# EAGLE design sonar_amp (EAGLE 8.6.1)
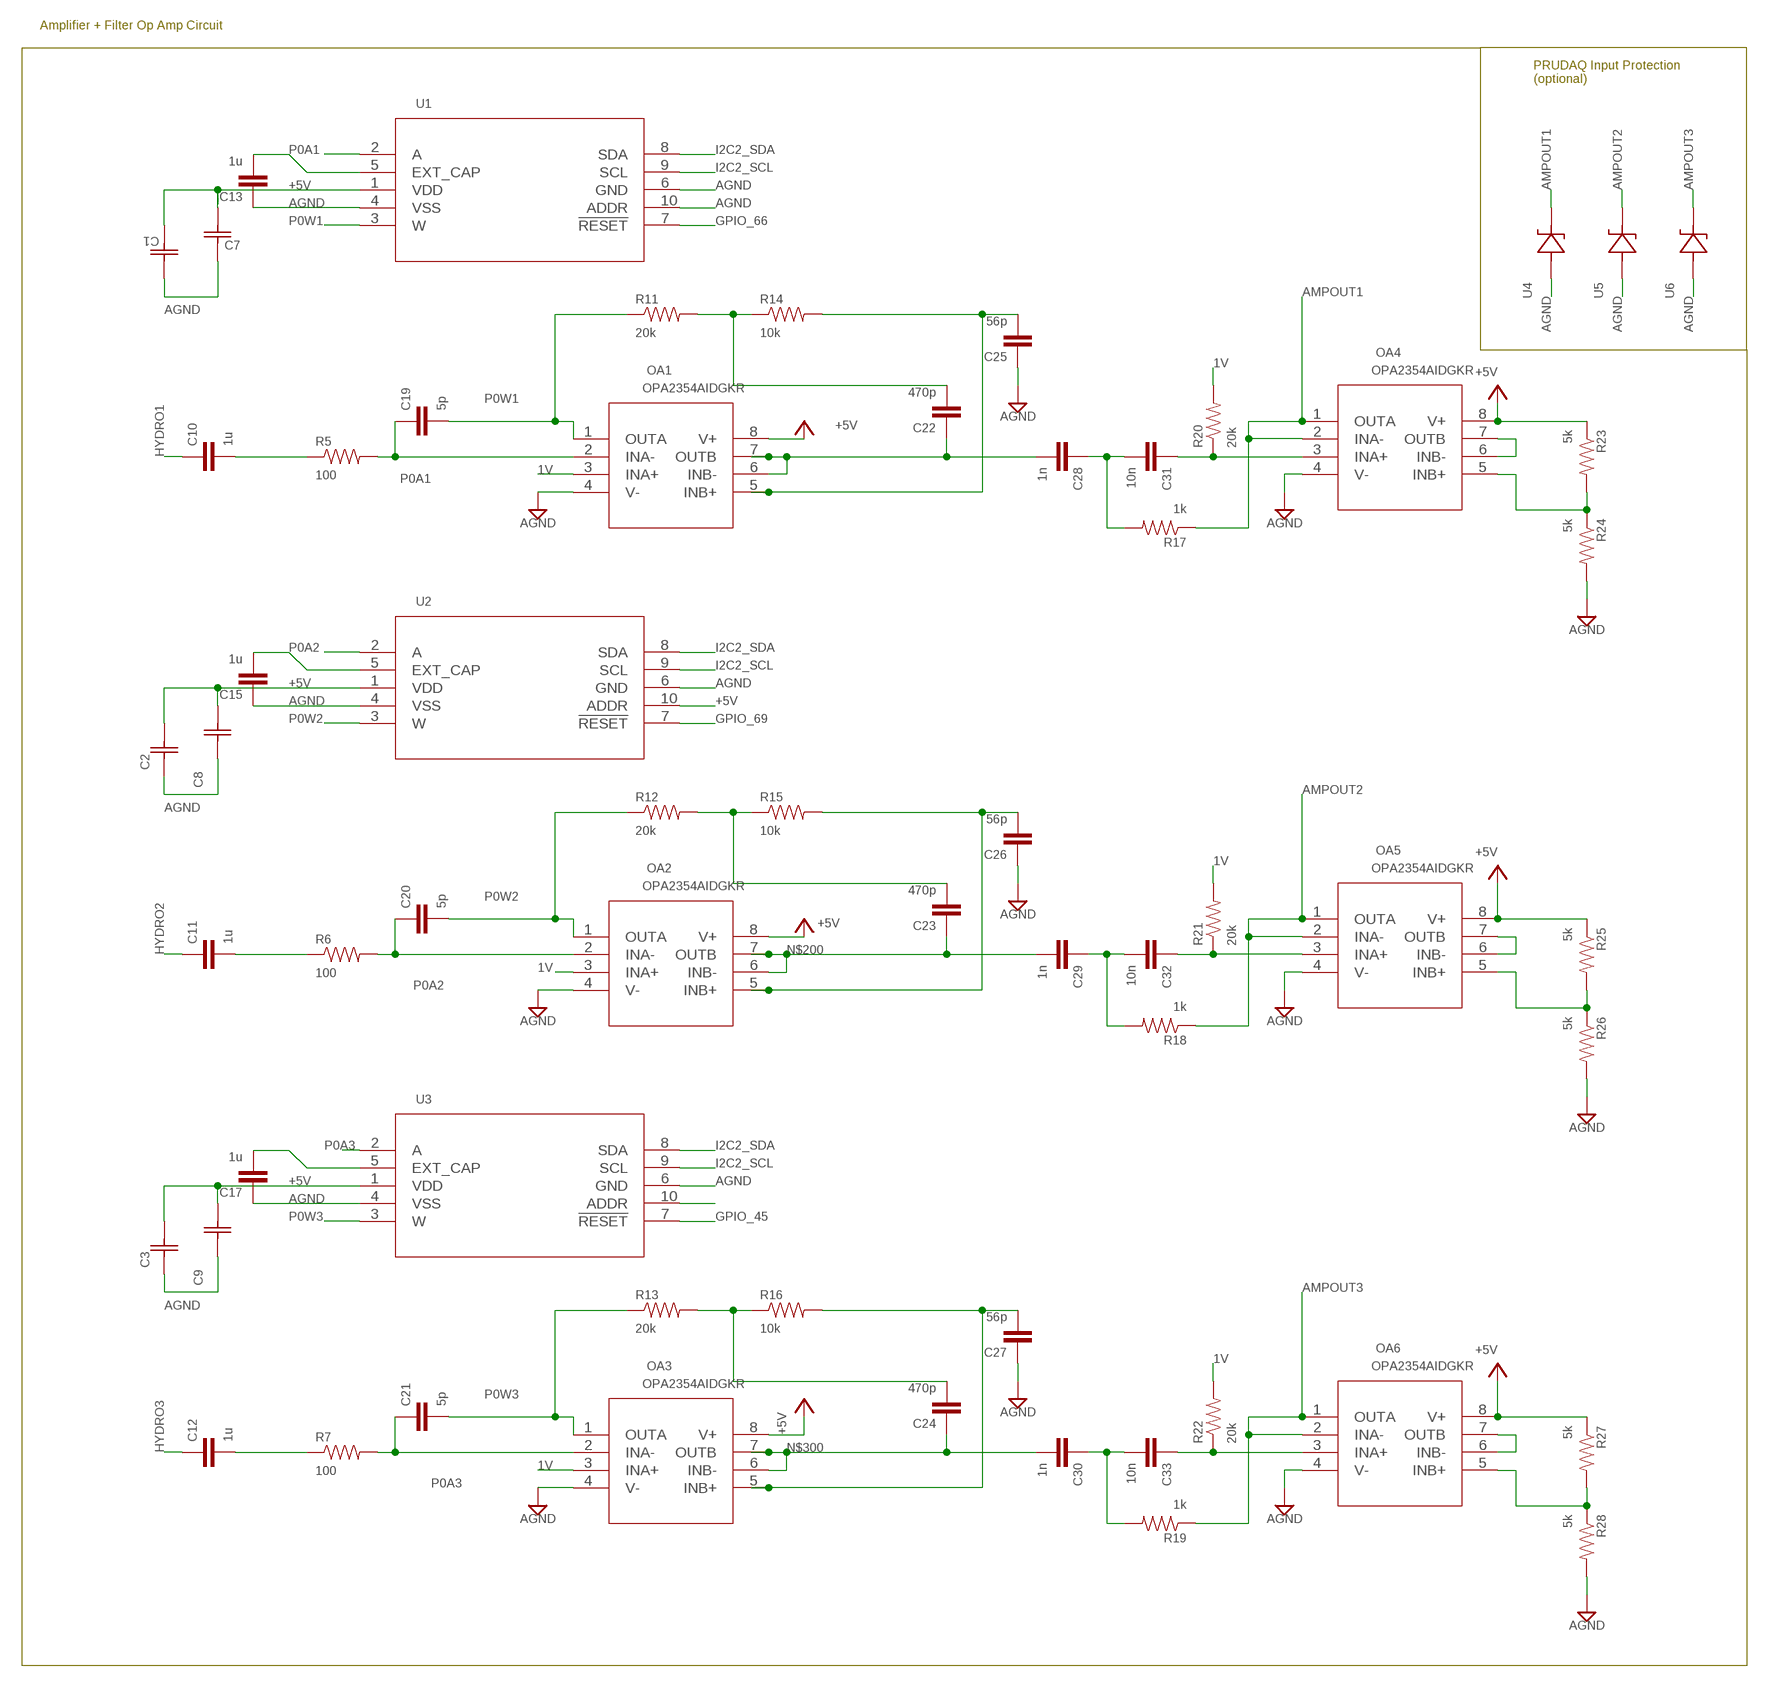
[diagram p0: schematic, sheet 1, part 1 of 2]
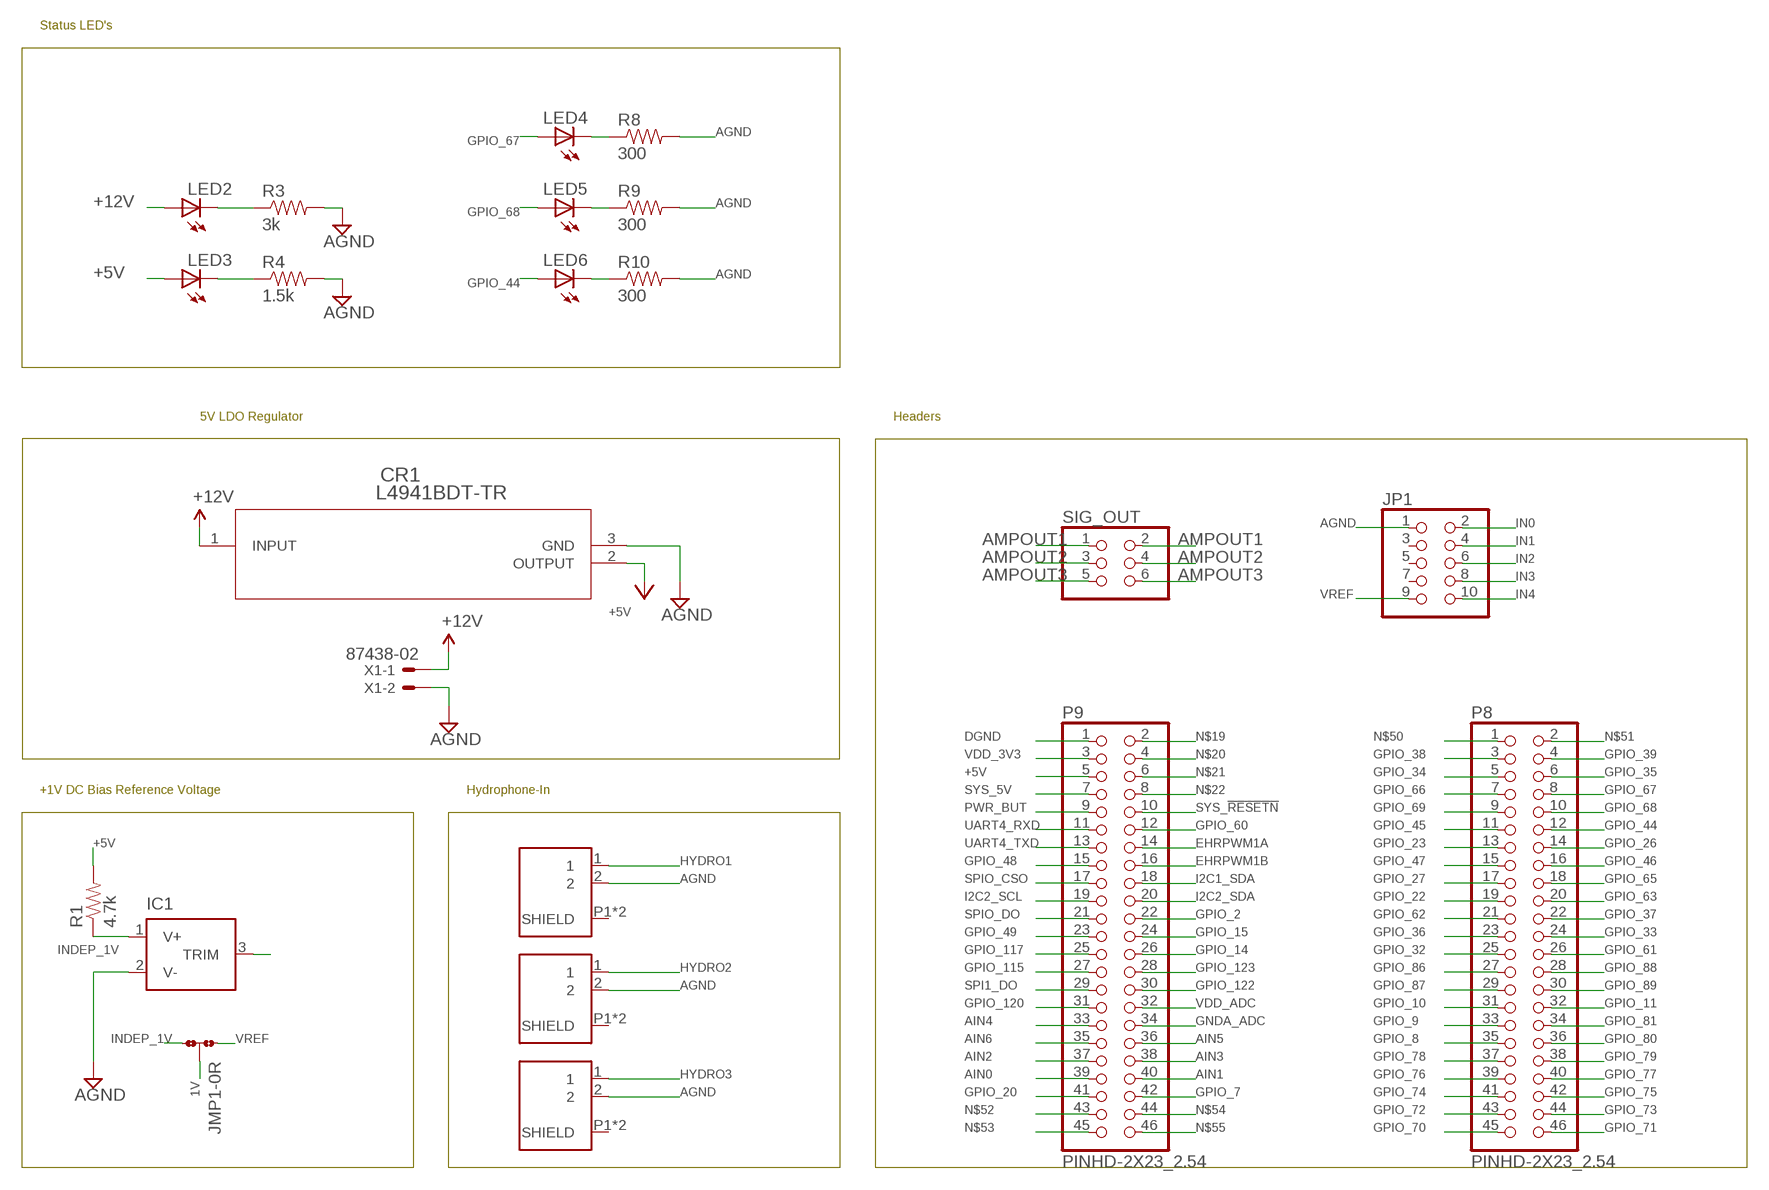
[diagram p1: schematic, sheet 1, part 2 of 2]

## Parts
C1  CC0805KRX7R7BB104  [CC0805N]
C2  CC0805KRX7R7BB104  [CC0805N]
C3  CC0805KRX7R7BB104  [CC0805N]
C7  CC0805ZKY5V6BB106  [YAG_CC0805]
C8  CC0805ZKY5V6BB106  [YAG_CC0805]
C9  CC0805ZKY5V6BB106  [YAG_CC0805]
C10  1u  1UF-25V-10%(0805)"  [0805-CAP]
C11  1u  1UF-25V-10%(0805)"  [0805-CAP]
C12  1u  1UF-25V-10%(0805)"  [0805-CAP]
C13  1u  1UF-25V-10%(0805)"  [0805-CAP]
C15  1u  1UF-25V-10%(0805)"  [0805-CAP]
C17  1u  1UF-25V-10%(0805)"  [0805-CAP]
C19  5p  1UF-25V-10%(0805)"  [0805-CAP]
C20  5p  1UF-25V-10%(0805)"  [0805-CAP]
C21  5p  1UF-25V-10%(0805)"  [0805-CAP]
C22  470p  1UF-25V-10%(0805)"  [0805-CAP]
C23  470p  1UF-25V-10%(0805)"  [0805-CAP]
C24  470p  1UF-25V-10%(0805)"  [0805-CAP]
C25  56p  1UF-25V-10%(0805)"  [0805-CAP]
C26  56p  1UF-25V-10%(0805)"  [0805-CAP]
C27  56p  1UF-25V-10%(0805)"  [0805-CAP]
C28  1n  1UF-25V-10%(0805)"  [0805-CAP]
C29  1n  1UF-25V-10%(0805)"  [0805-CAP]
C30  1n  1UF-25V-10%(0805)"  [0805-CAP]
C31  10n  1UF-25V-10%(0805)"  [0805-CAP]
C32  10n  1UF-25V-10%(0805)"  [0805-CAP]
C33  10n  1UF-25V-10%(0805)"  [0805-CAP]
CR1  L4941BDT-TR  [DPAK]
IC1  ADR510  [SOT23]
J1  1-1337543-0  [CONN_1-1337543-0]
J2  1-1337543-0  [CONN_1-1337543-0]
J3  1-1337543-0  [CONN_1-1337543-0]
JMP1  0R-JUMPC  [C0R-JMP]
JP1  PINHD-2X5  [2X05]
LED2  LEDSMT1206  [1206]
LED3  LEDSMT1206  [1206]
LED4  LEDSMT1206  [1206]
LED5  LEDSMT1206  [1206]
LED6  LEDSMT1206  [1206]
OA1  OPA2354AIDGKR  [DGK8]
OA2  OPA2354AIDGKR  [DGK8]
OA3  OPA2354AIDGKR  [DGK8]
OA4  OPA2354AIDGKR  [DGK8]
OA5  OPA2354AIDGKR  [DGK8]
OA6  OPA2354AIDGKR  [DGK8]
P8  PINHD-2X23_2.54  [2X23]
P9  PINHD-2X23_2.54  [2X23]
R1  4.7k  0.3OHM-1/8W-1%(0805)  [0805]
R3  3k  0.3OHM-1/8W-1%(0805)  [0805]
R4  1.5k  0.3OHM-1/8W-1%(0805)  [0805]
R5  100  0.3OHM-1/8W-1%(0805)  [0805]
R6  100  0.3OHM-1/8W-1%(0805)  [0805]
R7  100  0.3OHM-1/8W-1%(0805)  [0805]
R8  300  0.3OHM-1/8W-1%(0805)  [0805]
R9  300  0.3OHM-1/8W-1%(0805)  [0805]
R10  300  0.3OHM-1/8W-1%(0805)  [0805]
R11  20k  0.3OHM-1/8W-1%(0805)  [0805]
R12  20k  0.3OHM-1/8W-1%(0805)  [0805]
R13  20k  0.3OHM-1/8W-1%(0805)  [0805]
R14  10k  0.3OHM-1/8W-1%(0805)  [0805]
R15  10k  0.3OHM-1/8W-1%(0805)  [0805]
R16  10k  0.3OHM-1/8W-1%(0805)  [0805]
R17  1k  0.3OHM-1/8W-1%(0805)  [0805]
R18  1k  0.3OHM-1/8W-1%(0805)  [0805]
R19  1k  0.3OHM-1/8W-1%(0805)  [0805]
R20  20k  0.3OHM-1/8W-1%(0805)  [0805]
R21  20k  0.3OHM-1/8W-1%(0805)  [0805]
R22  20k  0.3OHM-1/8W-1%(0805)  [0805]
R23  5k  0.3OHM-1/8W-1%(0805)  [0805]
R24  5k  0.3OHM-1/8W-1%(0805)  [0805]
R25  5k  0.3OHM-1/8W-1%(0805)  [0805]
R26  5k  0.3OHM-1/8W-1%(0805)  [0805]
R27  5k  0.3OHM-1/8W-1%(0805)  [0805]
R28  5k  0.3OHM-1/8W-1%(0805)  [0805]
SIG_OUT  PINHD-2X3  [2X03]
U1  AD5272BRMZ-20RM_10-L  [RM_10-L]
U2  AD5272BRMZ-20RM_10-L  [RM_10-L]
U3  AD5272BRMZ-20RM_10-L  [RM_10-L]
U4  CZRF52C2CZRF-M  [CZRF-M]
U5  CZRF52C2CZRF-M  [CZRF-M]
U6  CZRF52C2CZRF-M  [CZRF-M]
X1  87438-02  [87438-02]

## Nets
1V: JMP1.2 OA1.3(INA+) OA2.3(INA+) OA3.3(INA+) R20.2 R21.2 R22.2
+5V: C1.2 C2.2 C3.2 C7.2 C8.2 C9.2 CR1.2(OUTPUT) LED3.A OA1.8(V+) OA2.8(V+) OA3.8(V+) OA4.8(V+) OA5.8(V+) OA6.8(V+) P9.5 R1.2 R23.1 R25.1 R27.1 U1.1(VDD) U2.1(VDD) U2.10(ADDR) U3.1(VDD)
+12V: CR1.1(INPUT) LED2.A X1.1
AGND: C1.1 C2.1 C3.1 C7.1 C8.1 C9.1 C13.1 C15.1 C17.1 C25.1 C26.1 C27.1 CR1.3(GND) IC1.2(V-) J1.2 J2.2 J3.2 JP1.1 OA1.4(V-) OA2.4(V-) OA3.4(V-) OA4.4(V-) OA5.4(V-) OA6.4(V-) R3.2 R4.2 R8.2 R9.2 R10.2 R24.2 R26.2 R28.2 U1.4(VSS) U1.6(GND) U1.10(ADDR) U2.4(VSS) U2.6(GND) U3.4(VSS) U3.6(GND) U4.2 U5.2 U6.2 X1.2
AIN0: P9.39
AIN1: P9.40
AIN2: P9.37
AIN3: P9.38
AIN4: P9.33
AIN5: P9.36
AIN6: P9.35
AMPOUT1: OA4.1(OUTA) OA4.2(INA-) R17.1 SIG_OUT.1 SIG_OUT.2 U4.1
AMPOUT2: OA5.1(OUTA) OA5.2(INA-) R18.1 SIG_OUT.3 SIG_OUT.4 U5.1
AMPOUT3: OA6.1(OUTA) OA6.2(INA-) R19.1 SIG_OUT.5 SIG_OUT.6 U6.1
DGND: P9.1
EHRPWM1A: P9.14
EHRPWM1B: P9.16
EXT_CAP: C13.2 U1.5(EXT_CAP)
GNDA_ADC: P9.34
GPIO_2: P9.22
GPIO_7: P9.42
GPIO_8: P8.35
GPIO_9: P8.33
GPIO_10: P8.31
GPIO_11: P8.32
GPIO_14: P9.26
GPIO_15: P9.24
GPIO_20: P9.41
GPIO_22: P8.19
GPIO_23: P8.13
GPIO_26: P8.14
GPIO_27: P8.17
GPIO_32: P8.25
GPIO_33: P8.24
GPIO_34: P8.5
GPIO_35: P8.6
GPIO_36: P8.23
GPIO_37: P8.22
GPIO_38: P8.3
GPIO_39: P8.4
GPIO_44: LED6.A P8.12
GPIO_45: P8.11 U3.7(!RESET)
GPIO_46: P8.16
GPIO_47: P8.15
GPIO_48: P9.15
GPIO_49: P9.23
GPIO_60: P9.12
GPIO_61: P8.26
GPIO_62: P8.21
GPIO_63: P8.20
GPIO_65: P8.18
GPIO_66: P8.7 U1.7(!RESET)
GPIO_67: LED4.A P8.8
GPIO_68: LED5.A P8.10
GPIO_69: P8.9 U2.7(!RESET)
GPIO_70: P8.45
GPIO_71: P8.46
GPIO_72: P8.43
GPIO_73: P8.44
GPIO_74: P8.41
GPIO_75: P8.42
GPIO_76: P8.39
GPIO_77: P8.40
GPIO_78: P8.37
GPIO_79: P8.38
GPIO_80: P8.36
GPIO_81: P8.34
GPIO_86: P8.27
GPIO_87: P8.29
GPIO_88: P8.28
GPIO_89: P8.30
GPIO_115: P9.27
GPIO_117: P9.25
GPIO_120: P9.31
GPIO_122: P9.30
GPIO_123: P9.28
HYDRO1: C10.1 J1.1
HYDRO2: C11.1 J2.1
HYDRO3: C12.1 J3.1
I2C1_SDA: P9.18
I2C2_SCL: P9.19 U1.9(SCL) U2.9(SCL) U3.9(SCL)
I2C2_SDA: P9.20 U1.8(SDA) U2.8(SDA) U3.8(SDA)
IN0: JP1.2
IN1: JP1.4
IN2: JP1.6
IN3: JP1.8
IN4: JP1.10
INDEP_1V: IC1.1(V+) JMP1.3 R1.1
N$1: C23.2 R12.2 R15.1
N$2: C22.2 R11.2 R14.1
N$3: C29.1 C32.2 R18.2
N$4: IC1.3(TRIM)
N$5: C32.1 OA5.3(INA+) R21.1
N$6: C28.1 C31.2 R17.2
N$7: C31.1 OA4.3(INA+) R20.1
N$9: LED2.C R3.1
N$10: LED3.C R4.1
N$11: LED4.C R8.1
N$12: OA6.5(INB+) R27.2 R28.1
N$13: C24.2 R13.2 R16.1
N$14: C30.1 C33.2 R19.2
N$15: C33.1 OA6.3(INA+) R22.1
N$16: OA6.6(INB-) OA6.7(OUTB)
N$17: OA4.5(INB+) R23.2 R24.1
N$18: LED5.C R9.1
N$19: P9.2
N$20: P9.4
N$21: P9.6
N$22: P9.8
N$23: LED6.C R10.1
N$25: C15.2 U2.5(EXT_CAP)
N$26: C17.2 U3.5(EXT_CAP)
N$27: U3.10(ADDR)
N$28: OA4.6(INB-) OA4.7(OUTB)
N$31: C22.1 C28.2 OA1.6(INB-) OA1.7(OUTB)
N$32: OA5.6(INB-) OA5.7(OUTB)
N$33: OA5.5(INB+) R25.2 R26.1
N$35: C26.2 OA2.5(INB+) R15.2
N$50: P8.1
N$51: P8.2
N$52: P9.43
N$53: P9.45
N$54: P9.44
N$55: P9.46
N$101: C25.2 OA1.5(INB+) R14.2
N$200: C23.1 C29.2 OA2.6(INB-) OA2.7(OUTB)
N$201: C27.2 OA3.5(INB+) R16.2
N$300: C24.1 C30.2 OA3.6(INB-) OA3.7(OUTB)
P0A1: C19.1 OA1.2(INA-) R5.2 U1.2(A)
P0A2: C20.1 OA2.2(INA-) R6.2 U2.2(A)
P0A3: C21.1 OA3.2(INA-) R7.2 U3.2(A)
P0W1: C19.2 OA1.1(OUTA) R11.1 U1.3(W)
P0W2: C20.2 OA2.1(OUTA) R12.1 U2.3(W)
P0W3: C21.2 OA3.1(OUTA) R13.1 U3.3(W)
POB: C10.2 R5.1
POB1: C11.2 R6.1
POB2: C12.2 R7.1
PWR_BUT: P9.9
SPI1_DO: P9.29
SPIO_CSO: P9.17
SPIO_DO: P9.21
SYS_5V: P9.7
SYS_!RESETN: P9.10
UART4_RXD: P9.11
UART4_TXD: P9.13
VDD_3V3: P9.3
VDD_ADC: P9.32
VREF: JMP1.1 JP1.9
Unconnected: J1.P1(SHIELD) J1.P2(SHIELD) J2.P1(SHIELD) J2.P2(SHIELD) J3.P1(SHIELD) J3.P2(SHIELD) JP1.3 JP1.5 JP1.7

## Notes on the sheet
- Amplifier + Filter Op Amp Circuit
- PRUDAQ Input Protection
  (optional)
- Status LED's
- 5V LDO Regulator | Headers
- +1V DC Bias Reference Voltage | Hydrophone-In

## Library data of the parts
C1-C3 = CC0805KRX7R7BB104:CC0805KRX7R7BB104; MANUFACTURER_PART_NUMBER: CC0805KRX7R7BB104; VENDOR: Yageo
C7-C9 = CC0805ZKY5V6BB106:CC0805ZKY5V6BB106; MANUFACTURER_PART_NUMBER: CC0805ZKY5V6BB106; VENDOR: Yageo
C10-C13 C15 C17 C19-C33 = SparkFun-Capacitors:1UF-25V-10%(0805): CAP-08064
CR1 = L4941BDT-TR:L4941BDT-TR; MANUFACTURER_PART_NUMBER: L4941BDTTR; VENDOR: ST Microelectronics
IC1 = SONAR:ADR510: 1.2V Voltage Reference 50ppm/°C, SOT23, 3-Terminal Source: Data sheet <http://datasheets.maxim-ic.com/en/ds/MAX6520.pdf>
J1-J3 = 1-1337543-0:1-1337543-0: BNC appliance socket, right angle [TE Connectivity] 1-1337543-0 BNC appliance socket, right angle; AVAILABILITY: Good; COMMENT: 1-1337543-0; DESCRIPTION: CONN BNC JACK R/A 50 OHM PCB; MF: TE Connectivity; MP: 1-1337543-0; NUMBER_OF_POSITIONS: 1; PACKAGE: None; PRICE: 1.28 USD
JMP1 = jump-0r-smd:0R-JUMP: SMD 0R 0805 Jumper
JP1 = pinhead:PINHD-2X5: PIN HEADER
LED2-LED6 = led:LED: LED OSRAM: - CHIPLED LG R971, LG N971, LY N971, LG Q971, LY Q971, LO R971, LY R971 LH N974, LH R974 LS Q976, LO Q976, LY Q976 LO Q996 - Hyper CHIPLED LW Q18S LB Q993, LB Q99A, LB R99A - SideLED LS A670, LO A670, LY A670, LG A670, LP A670 LB A673, LV A673, LT A673, LW A673 LH A674 LY A675 LS A676, LA A676, LO A676, LY A676, LW A676 LS A679, LY A679, LG A679 - Hyper Micro SIDELED® LS Y876, LA Y876, LO Y876, LY Y876 LT Y87S - SmartLED LW L88C, LW L88S LB L89C, LB L89S, LG L890 LS L89K, LO L89K, LY L89K LS L896, LA L896, LO L896, LY L896 - TOPLED LS T670, LO T670, LY T670, LG T670, LP T670 LSG T670, LSP T670, LSY T670, LOP T670, LYG T670 LG T671, LOG T671, LSG T671 LB T673, LV T673, LT T673, LW T673 LH T674 LS T676, LA T676, LO T676, LY T676, LB T676, LH T676, LSB T676, LW T676 LB T67C, LV T67C, LT T67C, LS T67K, LO T67K, LY T67K, LW E67C LS E67B, LA E67B, LO E67B, LY E67B, LB E67C, LV E67C, LT E67C LW T67C LS T679, LY T679, LG T679 LS T770, LO T770, LY T770, LG T770, LP T770 LB T773, LV T773, LT T773, LW T773 LH T774 LS E675, LA E675, LY E675, LS T675 LS T776, LA T776, LO T776, LY T776, LB T776 LHGB T686 LT T68C, LB T68C - Hyper Mini TOPLED® LB M676 - Mini TOPLED Santana® LG M470 LS M47K, LO M47K, LY M47K Source: http://www.osram.convergy.de LUXEON: - LUMILED® LXK2-PW12-R00, LXK2-PW12-S00, LXK2-PW14-U00, LXK2-PW14-V00 LXK2-PM12-R00, LXK2-PM12-S00, LXK2-PM14-U00 LXK2-PE12-Q00, LXK2-PE12-R00, LXK2-PE12-S00, LXK2-PE14-T00, LXK2-PE14-U00 LXK2-PB12-K00, LXK2-PB12-L00, LXK2-PB12-M00, LXK2-PB14-N00, LXK2-PB14-P00, LXK2-PB14-Q00 LXK2-PR12-L00, LXK2-PR12-M00, LXK2-PR14-Q00, LXK2-PR14-R00 LXK2-PD12-Q00, LXK2-PD12-R00, LXK2-PD12-S00 LXK2-PH12-R00, LXK2-PH12-S00 LXK2-PL12-P00, LXK2-PL12-Q00, LXK2-PL12-R00 Source: www.luxeon.com KINGBRIGHT: KA-3528ASYC Source: www.kingbright.com
OA1-OA6 = OPA2354AIDGKR_Rev:OPA2354AIDGKR
P8 P9 = pinhead-1:PINHD-2X23: PIN HEADER
R1 R3-R28 = SparkFun-Resistors:0.3OHM-1/8W-1%(0805): RES-11622; PROD_ID: RES-11622; VALUE: 0.3
SIG_OUT = pinhead:PINHD-2X3: PIN HEADER
U1-U3 = AD5272BRMZ-100:AD5272BRMZ-20; MANUFACTURER_PART_NUMBER: AD5272BRMZ20; VENDOR: Analog Devices Inc
U4-U6 = CZRF52C2:CZRF52C2; MANUFACTURER_PART_NUMBER: CZRF52C2; VENDOR: Comchip
X1 = con-molex:87438-02: Wire-to-Board 1.50mm (.059") Pitch Header - Right Angle, SMT, Shrouded Source: http://www.molex.com/product/micro/87438.html; MF: MOLEX; OC_FARNELL: 1711327; OC_NEWARK: unknown

## Board
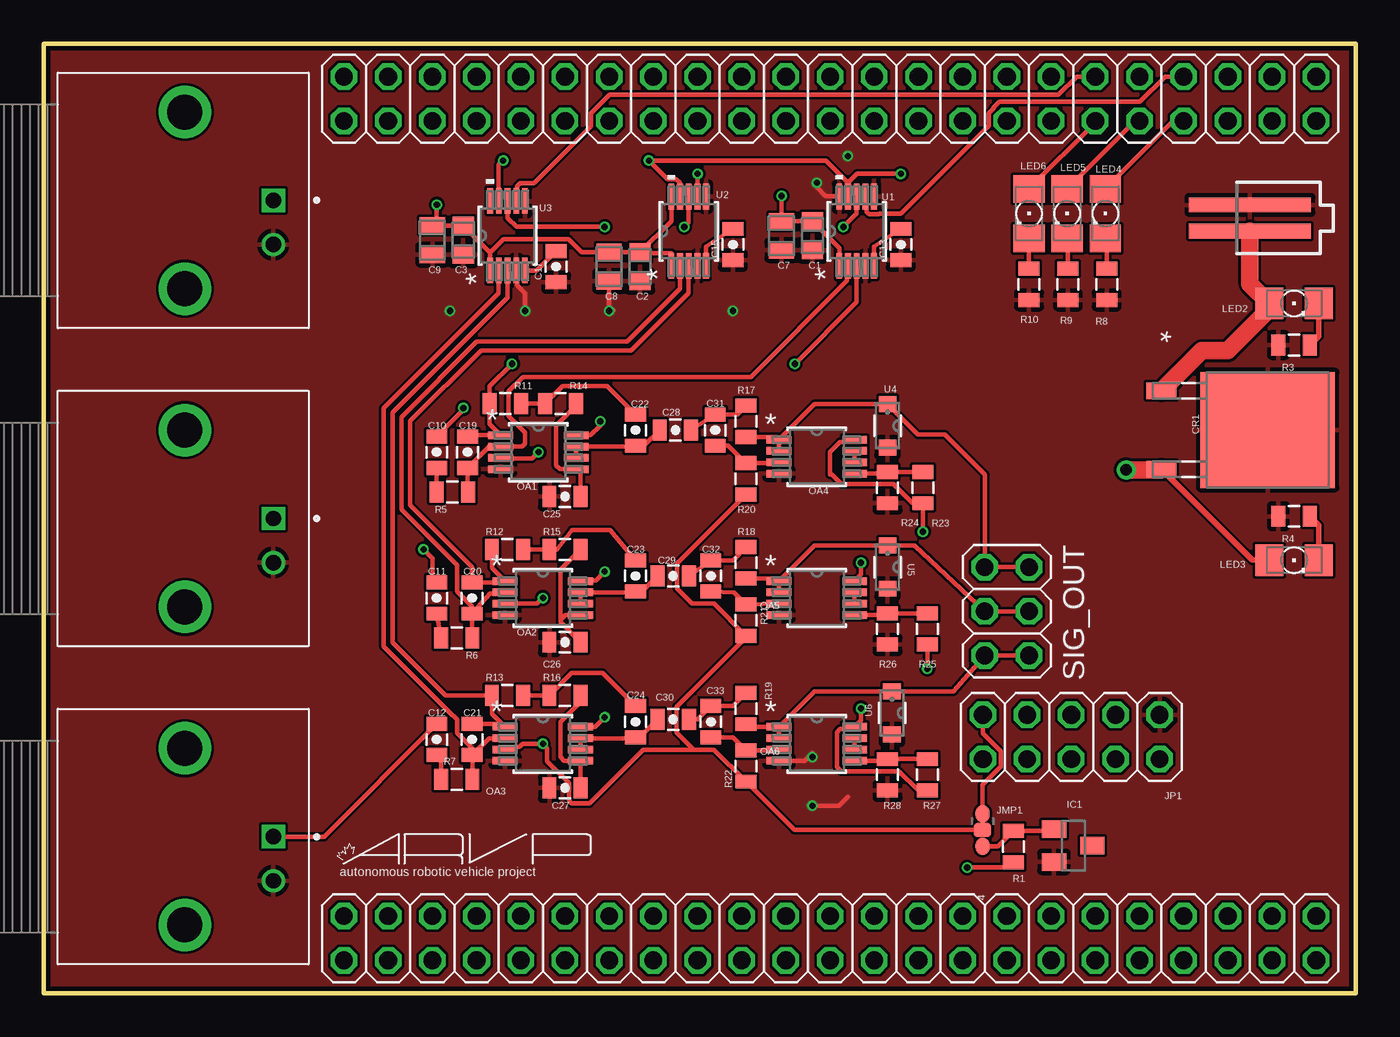
[diagram p2: board, top side]
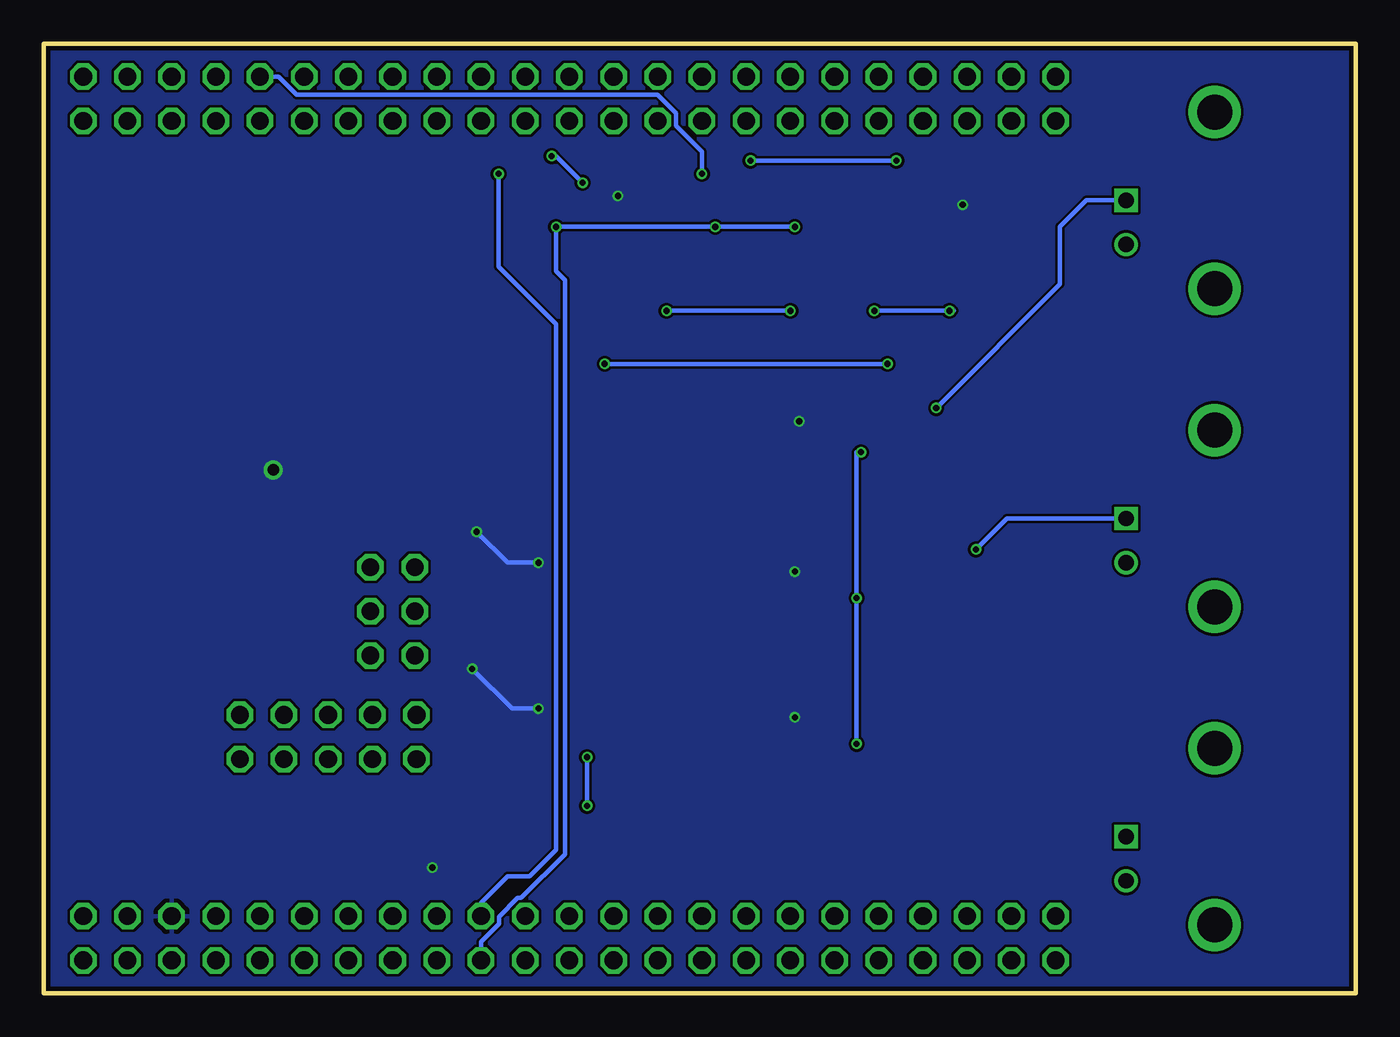
[diagram p3: board, bottom side, seen from below]

Size 75.44 x 54.61 mm. Coordinates in mm from the lower left corner, seen from the top.
Outline: 75.44,54.61 75.44,0 0,0 0,54.61 75.44,54.61
Copper layers (1*16): Top 0.035mm / dielectric 1.5mm / Bottom 0.035mm
Design rules "OSHPark2Layer": minimum track width 6mil, minimum drill 10mil, track to track 6mil, track to pad 6mil, pad to pad 6mil, via to via 6mil, smd to smd 0mil, copper to edge 10mil, drill to drill 10mil, minimum pad ring 5mil, minimum via ring 5mil, stop-mask expansion 2mil, vias tented up to drill 100mil, thermal gap 10mil

### Footprints (pad centres in the part's own frame; a part is rotated, then mirrored left to right if it is on the bottom)
CC0805N = smd 1.067 x 1.219: 1 -0.826,0; 2 0.826,0
YAG_CC0805 = smd 0.965 x 1.448: 1 -0.826,0; 2 0.826,0
0805-CAP = smd 0.8 x 1.2: 1 -0.9,0; 2 0.9,0
DPAK = smd 0.94 x 1.702: 1 -2.25,-6.109; 2 2.25,-6.109 | smd 6.655 x 7.722: 3 0,0
SOT23 = smd 1 x 1.4: 1 -0.95,-1.1; 2 0.95,-1.1; 3 0,1.1
CONN_1-1337543-0 = drill 0.89 square: 1 0,0 | drill 0.89: 2 0,-2.54 | drill 2.01: P1 -5.08,-5.08; P2 -5.08,5.08
C0R-JMP = smd 0.8 x 1: 1 0,0.938; 3 0,-0.938 | smd 1 x 0.8: 2 0,0
2X05 = drill 1.016 octagon: 1 -5.08,-1.27; 2 -5.08,1.27; 3 -2.54,-1.27; 4 -2.54,1.27; 5 0,-1.27; 6 0,1.27; 7 2.54,-1.27; 8 2.54,1.27; 9 5.08,-1.27; 10 5.08,1.27
1206 = smd 1.6 x 1.803: A -1.422,0; C 1.422,0
DGK8 = smd 1.422 x 0.432: 1 -2.172,0.975; 2 -2.172,0.325; 3 -2.172,-0.325; 4 -2.172,-0.975; 5 2.172,-0.975; 6 2.172,-0.325; 7 2.172,0.325; 8 2.172,0.975
2X23 = drill 1.016 octagon: 1 -25.4,-1.27; 2 -25.4,1.27; 3 -22.86,-1.27; 4 -22.86,1.27; 5 -20.32,-1.27; 6 -20.32,1.27; 7 -17.78,-1.27; 8 -17.78,1.27; 9 -15.24,-1.27; 10 -15.24,1.27; 11 -12.7,-1.27; 12 -12.7,1.27; 13 -10.16,-1.27; 14 -10.16,1.27; 15 -7.62,-1.27; 16 -7.62,1.27; 17 -5.08,-1.27; 18 -5.08,1.27; 19 -2.54,-1.27; 20 -2.54,1.27; 21 0,-1.27; 22 0,1.27; 23 2.54,-1.27; 24 2.54,1.27; 25 5.08,-1.27; 26 5.08,1.27; 27 7.62,-1.27; 28 7.62,1.27; 29 10.16,-1.27; 30 10.16,1.27; 31 12.7,-1.27; 32 12.7,1.27; 33 15.24,-1.27; 34 15.24,1.27; 35 17.78,-1.27; 36 17.78,1.27; 37 20.32,-1.27; 38 20.32,1.27; 39 22.86,-1.27; 40 22.86,1.27; 41 25.4,-1.27; 42 25.4,1.27; 43 27.94,-1.27; 44 27.94,1.27; 45 30.48,-1.27; 46 30.48,1.27
0805 = smd 0.8 x 1.2: 1 -0.9,0; 2 0.9,0
2X03 = drill 1.016 octagon: 1 -2.54,-1.27; 2 -2.54,1.27; 3 0,-1.27; 4 0,1.27; 5 2.54,-1.27; 6 2.54,1.27
RM_10-L = smd 1.473 x 0.33: 1 -1.994,1; 2 -1.994,0.5; 3 -1.994,0; 4 -1.994,-0.5; 5 -1.994,-1; 6 1.994,-1; 7 1.994,-0.5; 8 1.994,0; 9 1.994,0.5; 10 1.994,1
CZRF-M = smd 0.914 x 1.016: 1 -1.245,0; 2 1.245,0
87438-02 = smd 7 x 0.85: 1 0,0.75; 2 0,-0.75

### Placement (x,y rotation side)
C1  44.2,43.56 90 top
C2  34.29,41.78 90 top
C3  24.13,43.31 90 top
C7  42.42,43.56 90 top
C8  32.51,41.78 90 top
C9  22.35,43.31 90 top
C10  22.61,31.11 270 top
C11  22.61,22.73 270 top
C12  22.61,14.61 270 top
C13  49.28,43.05 90 top
C15  39.62,43.05 90 top
C17  29.46,41.78 90 top
C19  24.38,31.11 90 top
C20  24.64,22.73 90 top
C21  24.64,14.61 90 top
C22  34.04,32.39 90 top
C23  34.04,24 90 top
C24  34.04,15.62 90 top
C25  29.97,28.57 0 top
C26  29.97,20.19 0 top
C27  29.97,11.81 0 top
C28  36.32,32.39 180 top
C29  36.19,24 180 top
C30  36.19,15.75 180 top
C31  38.61,32.39 90 top
C32  38.35,24 90 top
C33  38.35,15.62 90 top
CR1  70.36,32.39 270 top
IC1  59.18,8.51 270 top
J1  13.21,45.59 0 top
J2  13.21,27.31 0 top
J3  13.21,9.02 0 top
JMP1  53.97,9.4 0 top
JP1  59.07,14.75 180 top
LED2  71.88,39.67 0 top
LED3  71.88,24.91 0 top
LED4  61.03,44.83 270 top
LED5  58.84,44.83 270 top
LED6  56.64,44.83 270 top
OA1  28.45,31.11 0 top
OA2  28.7,22.73 0 top
OA3  28.7,14.35 0 top
OA4  44.45,30.86 0 top
OA5  44.45,22.73 0 top
OA6  44.45,14.35 0 top
P8  47.75,51.44 180 top
P9  47.75,3.18 180 top
R1  55.75,8.45 270 top
R3  71.88,37.27 180 top
R4  71.88,27.43 180 top
R5  23.49,28.83 0 top
R6  23.75,20.45 0 top
R7  23.75,12.32 0 top
R8  61.11,40.77 270 top
R9  58.88,40.77 270 top
R10  56.64,40.77 270 top
R11  26.54,33.91 0 top
R12  26.67,25.53 0 top
R13  26.67,17.14 0 top
R14  29.72,33.91 0 top
R15  29.97,25.53 0 top
R16  29.97,17.14 0 top
R17  40.39,32.89 90 top
R18  40.39,24.77 90 top
R19  40.39,16.38 90 top
R20  40.39,29.59 270 top
R21  40.39,21.46 270 top
R22  40.39,13.08 270 top
R23  50.55,29.08 90 top
R24  48.51,29.08 270 top
R25  50.8,20.96 90 top
R26  48.51,20.96 270 top
R27  50.8,12.57 90 top
R28  48.51,12.57 270 top
SIG_OUT  55.37,21.97 270 top
U1  46.74,43.81 90 top
U2  37.08,43.81 90 top
U3  26.67,43.56 90 top
U4  48.51,32.64 270 top
U5  48.51,24.51 270 top
U6  48.77,16.13 270 top
U$1  [ARVP]  17.02,6.73 0 top
X1  69.34,44.58 180 top

### Tracks (layer width: path | path; a pad name or v marks a point on that pad's centre or on a via)
1V  (via drill 0.35)
  Top 0.254: 37.4,14.02 36.39,15.02 36.39,16.47 40.39,20.47 R21.2 38.52,22.42 37.28,22.42 36.42,23.29 36.42,24.72 R20.2 | 37.4,14.02 38.55,14.02 R22.2 43.17,9.4 JMP1.2 | OA2.3 28.38,22.41 v28.7,22.73 | OA3.3 26.68,14.18 27.36,14.18 27.53,14.35 v28.7,14.35 28.96,14.1 28.96,13.34 30.19,12.1 30.19,11.1 30.36,10.93 31.39,10.93 34.47,14.02 37.4,14.02 | OA1.3 26.37,30.75 28.08,30.75 v28.45,31.11
  Bottom 0.254: v28.7,14.35 v28.7,22.73 28.7,31.11 v28.45,31.11
+5V  (via drill 0.35, 0.35 pad 0.55, 0.65 pad 1.1)
  Top 0.254: OA1.8 31.45,32.09 32,32.64 v32,32.89 | OA2.8 30.91,23.75 31.75,23.75 v32.26,24.26 | OA3.8 31.71,15.33 v32.26,15.88 | R27.1 50.27,11.67 49.18,12.77 45.87,12.77 45.61,13.03 45.61,15.02 45.78,15.2 46.49,15.2 OA6.8 46.99,15.69 v46.99,16.38 | v53.09,7.24 55.45,7.24 R1.2 | 64.11,30 64.21,30.1 | OA4.8 46.49,31.71 45.78,31.71 45.21,31.13 45.21,29.85 45.3,29.85 45.87,29.28 48.85,29.28 49.94,28.18 R23.1 v50.55,26.54 | OA5.8 46.99,24.08 v46.99,24.77 | 50.8,19.94 R25.1 v50.8,18.67 | U1.1 45.74,42.85 C1.2 C7.2 v42.42,45.85 | U2.1 36.08,42.55 34.35,42.55 C2.2 | C2.2 C8.2 30.93,42.61 30.18,43.36 26.44,43.36 25.67,42.59 | C2.2 34.41,42.61 | U3.1 25.67,42.59 | 25.67,42.59 C3.2 C9.2 22.61,44.39 v22.61,45.34 | C2.2 36.08,44.4 U2.10
  Top 0.305: CR1.2 69.47,24.91 LED3.A
  Top 1.016: 64.21,30.1 arc90 CR1.2 64.21,30.1 | 64.21,30.1 v62.23,30.1
  Bottom 0.254: v46.99,24.77 48.77,24.77 v50.55,26.54 | v50.8,18.67 48.51,16.38 v46.99,16.38
  pour Bottom: 0.25,54.99 0.25,-0.38 74.93,-0.38 74.93,54.99
+12V
  Top 1.016: CR1.1 66.57,36.96 68.07,36.96 70.46,39.34 LED2.A 69.34,40.79 X1.1
AGND  (via drill 0.35)
  Top 0.254: OA6.4 43.73,13.38 44.2,13.84 v44.2,13.59 | v44.2,10.8 45.72,10.8 46.23,11.3 | U3.4 27.23,41.51 27.23,40.72 27.69,40.25 v27.69,39.24 | C8.1 32.51,39.5 32.77,39.24 v32.51,39.24 | U1.10 45.7,45.85 44.96,45.85 44.45,46.36 v44.45,46.61
  Bottom 0.254: v44.2,13.59 v44.2,10.8 | v27.69,39.24 v23.37,39.24 23.11,39.24 | v32.51,39.24 v39.62,39.24 | v44.45,46.61 45.97,48.13 v46.23,48.13
  pour Top: 0.25,54.99 0.25,-0.38 74.93,-0.38 74.93,54.99
AMPOUT1
  Top 0.254: OA4.2 OA4.1 | R17.1 42.12,31.99 OA4.1 | OA4.1 44.33,33.88 U4.1 50.27,32.13 51.82,32.13 54.1,29.85 SIG_OUT.1 SIG_OUT.2
AMPOUT2
  Top 0.254: OA5.2 OA5.1 | OA5.1 42.12,23.86 R18.1 | OA5.1 44.33,25.76 U5.1 50.06,25.76 SIG_OUT.3 SIG_OUT.4
AMPOUT3
  Top 0.254: OA6.2 OA6.1 | R19.1 40.54,15.33 OA6.1 | OA6.1 44.33,17.37 U6.1 52.3,17.37 SIG_OUT.5 SIG_OUT.6
EXT_CAP
  Top 0.254: C13.2 47.74,42.92 U1.5
GPIO_44
  Top 0.152: 56.64,46.36 LED6.A
  Top 0.254: LED6.A 60.45,50.06 P8.12
GPIO_45
  Top 0.254: P8.11 59.38,52.7 58.34,51.66 32.54,51.66 31.47,50.6 31.47,50.42 31.47,50.11 31.47,49.86 28.19,46.57 27.39,46.57 27.23,46.41 27.23,45.61 U3.7
GPIO_66
  Top 0.254: U1.7 47.29,45.75 47.29,44.96 47.45,44.79 48.02,44.79 48.05,44.83 49.28,44.83 54.33,49.89 54.33,50.6 54.61,50.88 54.61,50.93 54.94,51.26 63.02,51.26 64.47,52.7 P8.7
GPIO_67
  Top 0.254: LED4.A 64.94,50.17 P8.8
GPIO_68
  Top 0.254: LED5.A 62.75,50.17 P8.10
GPIO_69  (via drill 0.35)
  Top 0.254: U2.7 v37.59,47.12
  Bottom 0.254: P8.9 61.92,52.7 60.88,51.66 40.16,51.66 39.09,50.6 39.09,49.89 37.59,48.39 v37.59,47.12
HYDRO1  (via drill 0.35)
  Top 0.254: C10.1 24.13,33.54 v24.13,33.66
  Bottom 0.254: v24.13,33.66 17.02,40.77 17.02,44.07 15.49,45.59 J1.1
HYDRO2  (via drill 0.35)
  Top 0.254: C11.1 22.35,23.89 22.35,25.02 v21.84,25.53
  Bottom 0.254: v21.84,25.53 20.07,27.31 J2.1
HYDRO3
  Top 0.254: C12.1 16.12,9.02 J3.1
I2C2_SCL  (via drill 0.35)
  Top 0.254: U3.9 26.17,47.63 v26.42,47.88 | U2.9 36.58,46.61 36.36,46.83 35.85,46.83 v34.8,47.88 44.96,47.88 46.18,46.66 46.18,45.86 U1.9 46.29,45.86 46.29,46.66 46.75,47.12 v49.28,47.12
  Bottom 0.254: v26.42,47.88 v34.8,47.88 | v49.28,47.12 49.28,41.78 45.97,38.48 45.97,8.26 47.5,6.73 48.77,6.73 50.29,5.21 P9.19
I2C2_SDA  (via drill 0.35)
  Top 0.254: U3.8 26.67,44.58 27.18,44.07 v32.26,44.07 | v36.83,44.07 37.08,44.32 U2.8 | v45.97,44.07 46.74,44.83 U1.8
  Bottom 0.254: v32.26,44.07 v36.83,44.07 v45.97,44.07 45.97,41.53 45.47,41.02 45.47,8 47.98,5.49 48.18,5.49 49.25,4.42 49.25,4.01 50.29,2.97 P9.20
INDEP_1V
  Top 0.152: 58.03,9.41 IC1.1
  Top 0.254: 58.03,9.41 57.97,9.35 R1.1 54.87,8.46 JMP1.3
N$1
  Top 0.254: R12.2 R15.1 29.51,25.53 30.37,26.64 32.56,26.64 C23.2
N$2
  Top 0.254: R11.2 R14.1 29.83,34.92 32.4,34.92 C22.2
N$3
  Top 0.254: R18.2 39.62,24.9 C32.2 C29.1
N$5
  Top 0.254: C32.1 39.69,23.06 R21.1 OA5.3
N$6
  Top 0.254: C28.1 C31.2 39.88,33.28 R17.2
N$7
  Top 0.254: C31.1 39.33,31.49 40.25,30.57 R20.1 42.23,30.49 OA4.3
N$9
  Top 0.305: R3.1 73.3,37.8 LED2.C
N$10
  Top 0.305: R4.1 73.3,26.91 LED3.C
N$11
  Top 0.152: 61.03,41.67 R8.1
  Top 0.254: R8.1 61.11,43.33 LED4.C
N$12
  Top 0.254: R27.2 R28.1 48.16,13.38 OA6.5
N$13
  Top 0.254: R13.2 R16.1 30.34,18.42 32.14,18.42 C24.2
N$14
  Top 0.254: C30.1 37.58,15.75 C33.2 39.62,16.52 R19.2
N$15
  Top 0.254: OA6.3 42.23,13.98 R22.1 39.62,14.72 C33.1
N$16
  Top 0.254: OA6.6 OA6.7
N$17
  Top 0.254: OA4.5 48.41,29.89 R24.1 R23.2
N$18
  Top 0.254: LED5.C 58.88,43.37 R9.1
N$23
  Top 0.152: LED6.C
  Top 0.254: LED6.C R10.1 | LED6.C
N$25
  Top 0.254: U2.5 38.08,42.92 C15.2
N$26
  Top 0.254: U3.5 28.35,41.57 C17.2
N$28
  Top 0.254: OA4.7 OA4.6
N$31
  Top 0.254: C28.2 34.52,31.49 C22.1 33.99,31.44 OA1.7 OA1.6
N$32
  Top 0.254: OA5.6 OA5.7
N$33
  Top 0.254: R25.2 R26.1 48.42,21.76 OA5.5
N$35
  Top 0.254: C26.2 29.72,21.35 29.72,21.46 | R15.2 29.72,24.37 29.72,21.46 | OA2.5 30.01,21.76 29.72,21.46
N$101
  Top 0.254: C25.2 30.87,29.89 OA1.5 29.68,30.14 29.46,30.35 29.46,32.64 30.62,33.79 R14.2
N$200
  Top 0.254: OA2.6 OA2.7 33.99,23.06 C23.1 34.39,23.1 C29.2
N$201
  Top 0.254: C27.2 OA3.5 29.93,13.38 29.72,13.59 29.72,15.62 30.87,16.78 R16.2
N$300
  Top 0.254: OA3.6 OA3.7 33.99,14.68 C24.1 34.27,14.72 C30.2
P0A1
  Top 0.254: R5.2 24.38,28.84 C19.1 25.29,31.12 25.6,31.44 OA1.2 27.5,31.44 27.69,31.62 27.69,32.23 26.74,33.18 26.74,34.64 27.55,35.45 33.53,35.45 33.58,35.45 40.66,35.45 46.18,40.97 46.18,41.77 U1.2
P0A2
  Top 0.254: 24.67,21.83 C20.1 | C20.1 24.64,21.72 24.64,20.46 R6.2 | C20.1 25.65,22.99 26.46,22.99 OA2.2 | U2.2 36.58,40.51 33.53,37.47 24.89,37.47 20.57,33.15 20.57,27.81 23.76,24.63 23.76,23.12 24.64,22.24 C20.1
P0A3
  Top 0.254: C21.1 24.65,13.69 R7.2 | C21.1 25.61,14.68 OA3.2 | C21.1 24.64,14.11 23.76,14.99 23.76,15.75 23.32,16.18 23.31,16.18 19.56,19.94 19.56,33.66 26.16,40.26 U3.2
P0W1  (via drill 0.35)
  Top 0.254: C19.2 24.46,32.09 OA1.1 25.64,32.72 R11.1 25.64,34.91 v26.92,36.2 | U1.3 46.74,39.75 v43.18,36.2
  Bottom 0.254: v26.92,36.2 37.34,36.2 37.59,36.2 v43.18,36.2
P0W2
  Top 0.254: R12.1 25.77,24.47 OA2.1 26.45,23.63 C20.2 24.64,24.51 21.08,28.07 21.08,32.89 25.15,36.96 33.78,36.96 37.08,40.26 U2.3
P0W3
  Top 0.254: C21.2 26.35,15.51 OA3.1 25.77,16.09 R13.1 23.11,17.14 20.07,20.19 20.07,33.4 26.67,40 U3.3
POB
  Top 0.254: C10.2 22.59,30.2 R5.1
POB1
  Top 0.254: C11.2 22.86,20.46 R6.1
POB2
  Top 0.254: C12.2 22.85,13.46 R7.1
VREF
  Top 0.254: JMP1.1 53.97,11.99 55.03,13.05 55.03,13.91 53.99,14.95 JP1.9

### Text on the board
tNames: 4
tDocu: 1 | ARVP SONAR 2018 / Amp/Filter / M Bardwell & A Schroeder